# EAGLE design VCF-LM324-Mono (EAGLE 7.2.0)
Voltage-Controlled Low-Pass Filter using LM324 Quad-Opamp (Mono) http://electro-music.com/forum/topic-45231-0.html&postdays=0&postorder=asc&highlight=
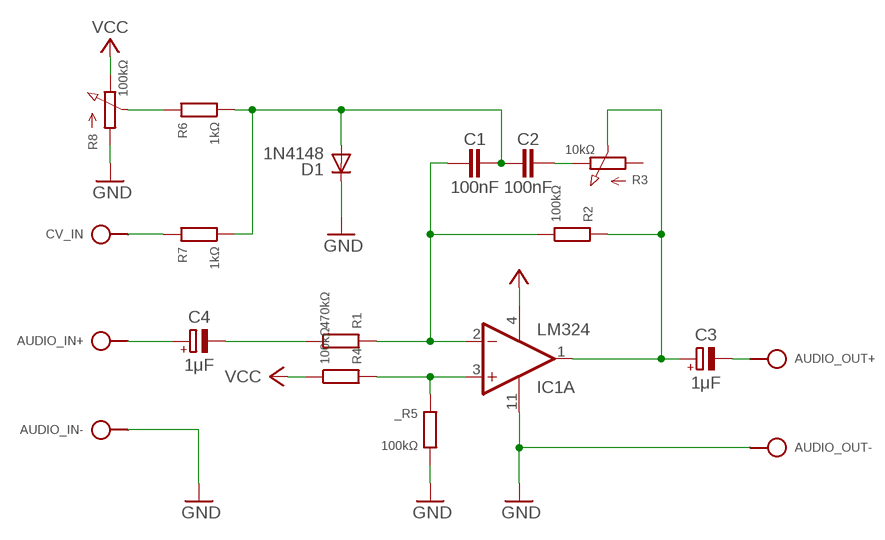
[diagram p0: schematic, sheet 1]

## Parts
_R5  100kΩ  R0202/7  [0202/7]
AUDIO_IN+  AUDIO_IN  SPAD  [SPAD]
AUDIO_IN-  SPAD  [SPAD]
AUDIO_OUT+  AUDIO_OUT  SPAD  [SPAD]
AUDIO_OUT-  SPAD  [SPAD]
C1  100nF  C050-024X044  [C050-024X044]
C2  100nF  C050-024X044  [C050-024X044]
C3  1μF  CPOLE2,5-3  [E2,5-3]
C4  1μF  CPOLE2,5-3  [E2,5-3]
CV_IN  CV_IN  SPAD  [SPAD]
D1  1N4148  1N414834-7  [DO34-7]
IC1  LM324  LM324N  [DIL14]
R1  470kΩ  R0202/7  [0202/7]
R2  100kΩ  R0202V  [0202V]
R3  10kΩ  POT-P5  [POT-P5]
R4  100kΩ  R0202V  [0202V]
R6  1kΩ  R0202/10  [0202/10]
R7  1kΩ  R0202/7  [0202/7]
R8  100kΩ  POT-P5  [POT-P5]

## Nets
GND: _R5.1 AUDIO_IN-.1 AUDIO_OUT-.1 D1.C IC1.11(P:V-) R8.A
N$1: AUDIO_IN+.1 C4.+
N$2: C1.1 IC1.2(A:-IN) R1.2 R2.1
N$3: C2.2 R3.E
N$4: C3.+ IC1.1(A:OUT) R2.2 R3.S
N$5: R6.2 R8.S
N$6: AUDIO_OUT+.1 C3.-
N$7: _R5.2 IC1.3(A:+IN) R4.2
N$8: CV_IN.1 R7.2
N$9: C1.2 C2.1 D1.A R6.1 R7.1
N$10: C4.- R1.1
VCC: IC1.4(P:V+) R4.1 R8.E
Unconnected: IC1.5(B:+IN) IC1.6(B:-IN) IC1.7(B:OUT) IC1.8(C:OUT) IC1.9(C:-IN) IC1.10(C:+IN) IC1.12(D:+IN) IC1.13(D:-IN) IC1.14(D:OUT) R3.A

## Library data of the parts
_R5 R1 R2 R4 R6 R7 = r:R: RESISTOR, European symbol
AUDIO_IN+ AUDIO_IN- AUDIO_OUT+ AUDIO_OUT- CV_IN = pad:SPAD
C1 C2 = c:C: CAPACITOR, European symbol
C3 C4 = c:CPOL: POLARIZED CAPACITOR, European symbol
D1 = d:1N4148
IC1 = ic:LM324: OP AMP
R3 R8 = r:POT

## Board
Voltage-Controlled Low-Pass Filter using LM324 Quad-Opamp (Mono) http://electro-music.com/forum/topic-45231-0.html&postdays=0&postorder=asc&highlight=
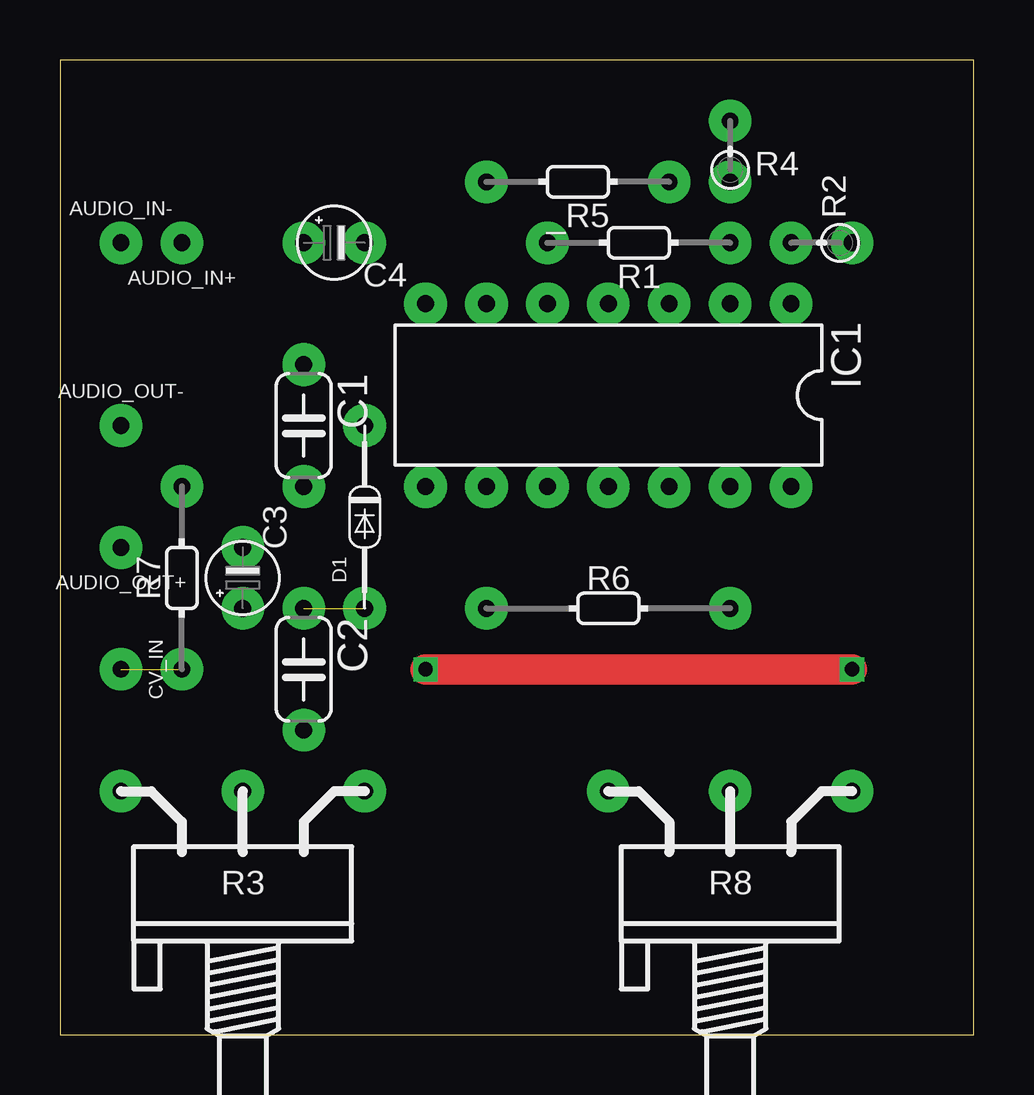
[diagram p1: board, top side]
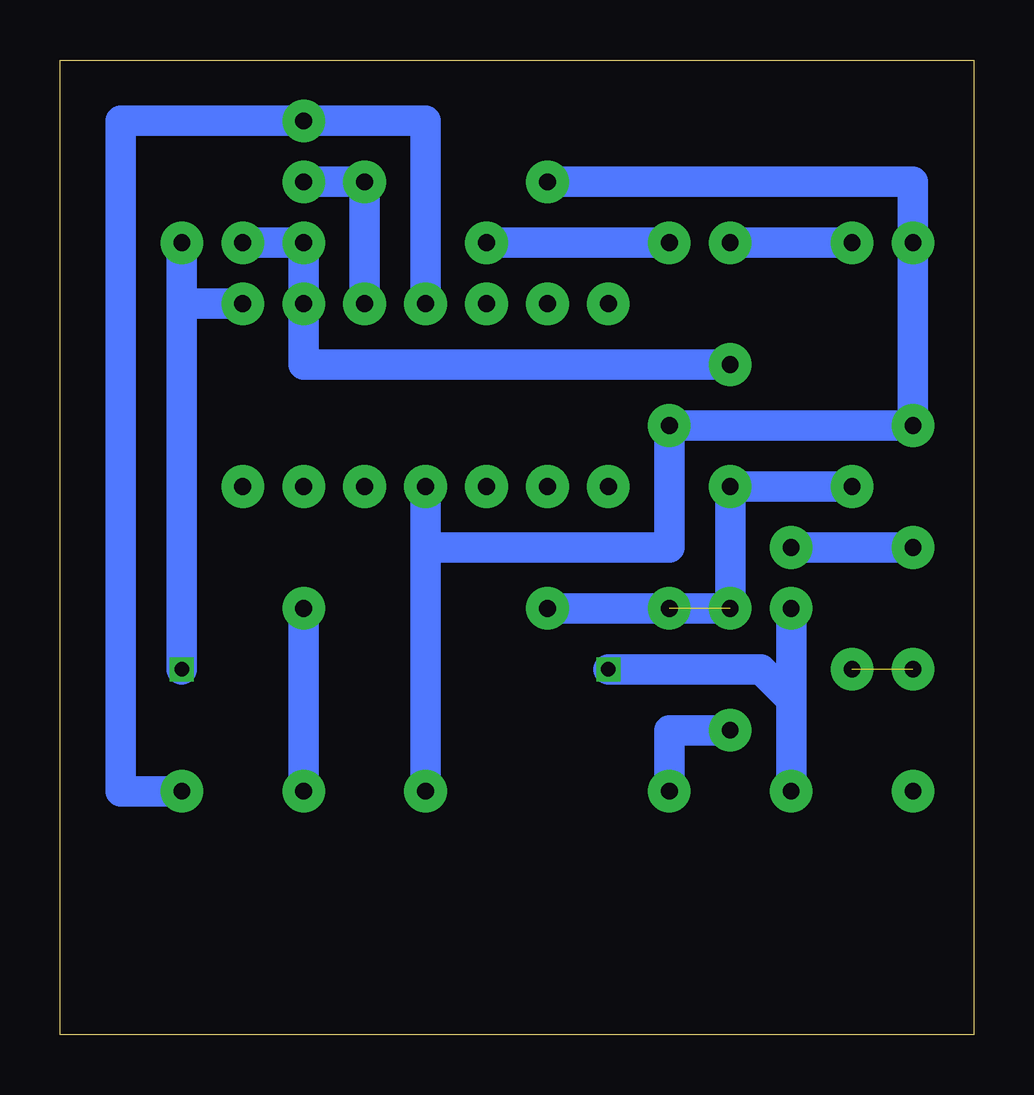
[diagram p2: board, bottom side, seen from below]

Size 38.1 x 40.64 mm. Coordinates in mm from the lower left corner, seen from the top.
Outline: 38.1,40.64 0,40.64 0,0 38.1,0 38.1,40.64
Copper layers (1*16): Top 0.035mm / dielectric 1.5mm / Bottom 0.035mm
Design rules "default": minimum track width 10mil, minimum drill 24mil, track to track 8mil, track to pad 8mil, pad to pad 8mil, via to via 8mil, smd to smd 8mil, copper to edge 40mil, drill to drill 8mil, minimum pad ring 10mil, minimum via ring 8mil, stop-mask expansion 4mil, vias tented up to drill 0mil, thermal gap 10mil

### Footprints (pad centres in the part's own frame; a part is rotated, then mirrored left to right if it is on the bottom)
0202/7 = drill 0.7 pad 1.778: 1 0,3.81; 2 0,-3.81
SPAD = drill 0.7 pad 1.778: 1 0,0
C050-024X044 = drill 0.7 pad 1.778: 1 -2.54,0; 2 2.54,0
E2,5-3 = drill 0.7 pad 1.778: + 1.27,0; - -1.27,0
DO34-7 = drill 0.7 pad 1.778: A 3.81,0; C -3.81,0
DIL14 = drill 0.7 pad 1.778: 1 -7.62,-3.81; 2 -5.08,-3.81; 3 -2.54,-3.81; 4 0,-3.81; 5 2.54,-3.81; 6 5.08,-3.81; 7 7.62,-3.81; 8 7.62,3.81; 9 5.08,3.81; 10 2.54,3.81; 11 0,3.81; 12 -2.54,3.81; 13 -5.08,3.81; 14 -7.62,3.81
0202V = drill 0.7 pad 1.778: 1 0,-1.27; 2 0,1.27
POT-P5 = drill 0.7 pad 1.778: A -5.08,3.81; E 5.08,3.81; S 0,3.81
0202/10 = drill 0.7 pad 1.778: 1 -5.08,0; 2 5.08,0

### Placement (x,y rotation side)
_R5  21.59,35.56 90 top
AUDIO_IN+  5.08,33.02 90 top
AUDIO_IN-  2.54,33.02 270 top
AUDIO_OUT+  2.54,20.32 90 top
AUDIO_OUT-  2.54,25.4 270 top
C1  10.16,25.4 270 top
C2  10.16,15.24 270 top
C3  7.62,19.05 270 top
C4  11.43,33.02 180 top
CV_IN  2.54,15.24 180 top
D1  12.7,21.59 270 top
IC1  22.86,26.67 180 top
R1  24.13,33.02 90 top
R2  31.75,33.02 270 top
R3  7.62,6.35 0 top
R4  27.94,36.83 180 top
R6  22.86,17.78 0 top
R7  5.08,19.05 0 top
R8  27.94,6.35 0 top

### Tracks (layer width: path | path; a pad name or v marks a point on that pad's centre or on a via)
GND
  Bottom 1.27: 22.86,21.59 IC1.11 | IC1.11 | 22.86,21.59 | _R5.1 2.54,35.56 AUDIO_IN-.1 AUDIO_OUT-.1 D1.C 12.7,20.32 22.86,20.32 | 22.86,21.59 IC1.11 | R8.A 22.86,20.32 | 22.86,20.32 IC1.11
N$1
  Bottom 1.27: C4.+ AUDIO_IN+.1
N$2
  Bottom 1.27: C1.1 27.94,27.94 IC1.2 R1.2 R2.1
N$3
  Bottom 1.27: C2.2 12.7,12.7 R3.E
N$4  (via drill 0.6)
  Top 1.27: v15.24,15.24 v33.02,15.24
  Bottom 1.27: 33.02,30.48 R2.2 | IC1.1 33.02,30.48 | 33.02,30.48 v33.02,15.24 | v15.24,15.24 8.89,15.24 7.62,13.97 C3.+ R3.S
N$5
  Bottom 1.27: R6.2 R8.S
N$6
  Bottom 1.27: AUDIO_OUT+.1 C3.-
N$7
  Bottom 1.27: R4.2 _R5.2 IC1.3
N$8  (1 unrouted)
N$9  (1 unrouted)
  Bottom 1.27: R7.1 C1.2 C2.1 R6.1
N$10
  Bottom 1.27: R1.1 C4.-
VCC
  Bottom 1.27: R8.E 35.56,10.16 35.56,38.1 R4.1 22.86,38.1 IC1.4